# Altium schematic sheet Amplifier-TPA2016D2.SchDoc: Speaker Amplifier
size A; DocumentNumber: 7; SheetNumber: 7; SheetTotal: 9
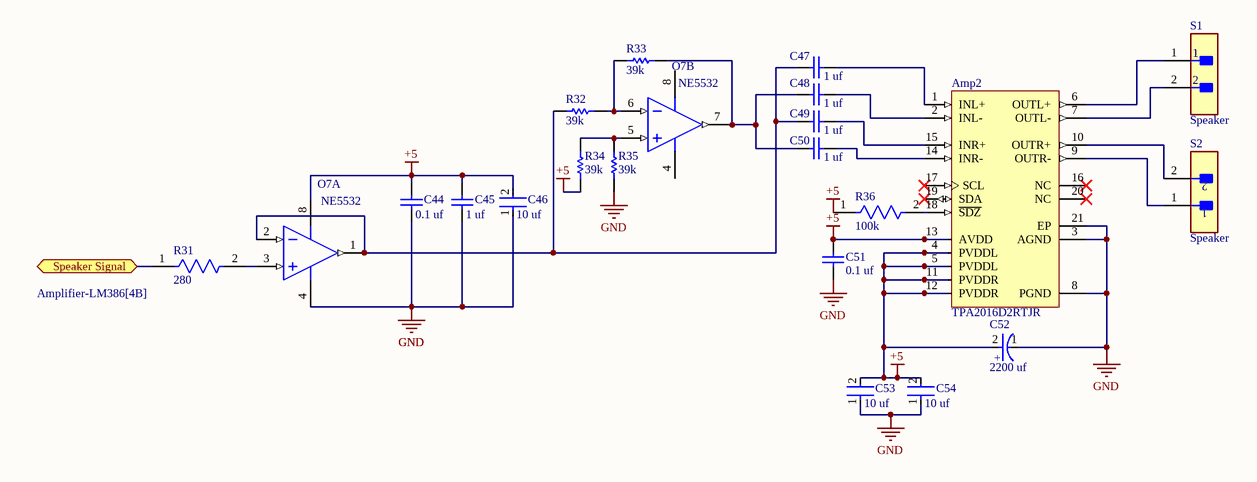
[diagram p0: Amplifier-TPA2016D2.SchDoc]

## Parts
Amp2  TPA2016D2RTJR  [RTJ0020D_V]
C44  0.1 uf  [CAPC2013X135X45ML10T25]
C45  1 uf  [CAPC2013X145X50LL20T25]
C46  10 uf  [FP-C0805C-DG-MFG]
C47  1 uf  [CAPC2013X135X45ML10T25]
C48  1 uf  [CAPC2013X135X45ML10T25]
C49  1 uf  [CAPC2013X135X45ML10T25]
C50  1 uf  [CAPC2013X135X45ML10T25]
C51  0.1 uf  [CAPC2013X135X45ML10T25]
C52  2200 uf  [FP-RAD-TH-D_10_0_5-L_16_1-MFG]
C53  10 uf  [FP-C0805C-DG-MFG]
C54  10 uf  [FP-C0805C-DG-MFG]
O7  NE5532  [ONSC-SOIC-8-751-07_V]  (parts A,B of 2)
R31  280  [FP-CRCW0805-e3-MFG]
R32  39k  [RESC2013X70X40NL20T20]
R33  39k  [RESC2013X70X40NL20T20]
R34  39k  [RESC2013X70X40NL20T20]
R35  39k  [RESC2013X70X40NL20T20]
R36  100k  [FP-RC0805-0_6-IPC_C]
S1  Speaker  [FP-B2B-XH-A_LF_SN-MFG]
S2  Speaker  [FP-B2B-XH-A_LF_SN-MFG]

## Ports
Speaker Signal (bidir, see Amplifier-LM386[4B])

## Nets
+5: Amp2.4(PVDDL) Amp2.5(PVDDL) Amp2.11(PVDDR) Amp2.12(PVDDR) Amp2.13(AVDD) C44.2 C45.1 C46.2 C51.2 C52.2(A) C53.2 C54.2 O7.8(V+) R34.1 R36.1
GND: Amp2.3(AGND) Amp2.8(PGND) Amp2.21(EP) C44.1 C45.2 C46.1 C51.1 C52.1(C) C53.1 C54.1 O7.4(V-) R35.1
Speaker Signal: R31.1 ; port Speaker Signal
NetAmp2_1: Amp2.1(INL+) C47.2
NetAmp2_2: Amp2.2(INL-) C48.2
NetAmp2_6: Amp2.6(OUTL+) S1.1
NetAmp2_7: Amp2.7(OUTL-) S1.2
NetAmp2_9: Amp2.9(OUTR-) S2.1
NetAmp2_10: Amp2.10(OUTR+) S2.2
NetAmp2_14: Amp2.14(INR-) C50.2
NetAmp2_15: Amp2.15(INR+) C49.2
NetAmp2_18: Amp2.18(~{SDZ}) R36.2
NetC47_1: C47.1 C49.1 O7.1(OUTA) O7.2(INA-) R32.1
NetC48_1: C48.1 C50.1 O7.7(OUTB) R33.2
NetO7_3: O7.3(INA+) R31.2
NetO7_5: O7.5(INB+) R34.2 R35.2
NetO7_6: O7.6(INB-) R32.2 R33.1

Not connected (* = marked no-connect by the designer): Amp2 16(NC)* 17(SCL)* 19(SDA)* 20(NC)*

## Notes on the sheet
- Title
- Size
- Date:
- A
- Drawn By:
- Sheet    of
- Revision
- File:
- Document Number:
- (in symbol CMP-05427-000639-1) +

## Library data of the parts
Amp2 = CMP-0991-00196-2: 2.8-W/Ch Stereo Class-D Audio Amplifier with SmartGainTM AGC / DRC, -40 to 85 degC, 20-pin QFN (RTJ20), Green (RoHS & no Sb/Br); Manufacturer: Texas Instruments; PSRR(dB): -80; Supply Max(Max)(Volt): 5.5; Output Power(W): 2.8; Supply Min(Min)(Volt): 2.5; SubFamily: Dynamic Speaker; PackageReference: RTJ0020D; ComponentLink3Description: Package Specification; ComponentLink1URL: http://www.ti.com/; ComponentLink2Description: Datasheet; Eco-Plan: Green (RoHS & no Sb/Br); ComponentLink1Description: Manufacturer URL; Speaker Channels: Stereo; Special Features: AGC/DRC; DatasheetVersion: SLOS524D; Speaker Amp Type: Class-D; PackageVersion: 4205505/F, 07/2011; PackageDescription: 20-pin Plastic Flat Pack, Body 4 x 4 mm, Pitch 0.5 mm; ComponentLink3URL: http://www.ti.com/litv/pdf/mpqf156e; Mounting Technology: Surface Mount; ComponentLink2URL: http://www.ti.com/general/docs/lit/getliterature.tsp?genericPartNumber=TPA2016D2&fileType=pdf; PartNumber: TPA2016D2RTJR
C44 C47-C51 = CMP-2100-03644-1: Chip Capacitor, 0.1 uF, +/- 10%, 50 V, -55 to 125 degC, 0805 (2012 Metric), RoHS, Tape and Reel; Manufacturer: Murata; Voltage: 50V; Capacitance: 100nF; Insulation Resistance: 10GR; Dielectric Material: Ceramic; Dielectric: X7R; Package Description: 2-Pin Surface Mount Device, Body 2 x 1.25 mm; Manufacturer URL: http://www.murata.com/; Case Code (Imperial): 0805; Datasheet URL: http://psearch.en.murata.com/capacitor/product/GRM21BR71H104KA01%23.pdf; Termination: SMD/SMT; Lead Free: LeadFree; Package Quantity: 1; Mount: SurfaceMount; REACH SVHC: Unknown; Thickness: 0.053inch; Height: 1.25mm; Case/Package: 0805; Voltage Rating: 50V; Width: 0.049inch; Case Code (Metric): 2012; Material: Ceramic; Min Operating Temperature: -55degC; RoHSCompliant: true; Datasheet Version: 42675.0; Voltage Rating (DC): 50V; Tolerance: 10%; Package Reference: 0805; Depth: 1.25mm; Length: 2mm; Max Operating Temperature: 125degC; Packaging: TapeandReel; Number of Pins: 2; Radiation Hardening: No
C45 = CMP-1036-04746-2: Manufacturer: Kemet; Part Number: C0805C105K4PACTU
C46 C53 C54 = CMP-2007-03243-2: CAP CER 10UF 10V X5R 0805; Manufacturer Part Number: C0805C106K8PACTU; Manufacturer: Kemet; 3DS Part Number: 220-00001; Tolerance: 10%; Temperature Coefficient: 15%; Material: Ceramic; Device Class L2: Capacitors; Device Class L1: Passive Components; ComponentLink2URL: https://content.kemet.com/datasheets/KEM_C1006_X5R_SMD.pdf; Height: 1.4mm; Lead Free: Yes; Digikey Description: CAP CER 10UF 10V X5R 0805; Octopart: https://octopart.com/c0805c106k8pactu-kemet-98697; Capacitance: 10uF; Value: 10uF; Temperature Range Low: -55°C; Temperature: -55°C to +85°C; Automotive: No; Mouser Description: CAP CER 10UF 10V X5R 0805; Ipc Land Pattern Name: CAPC200125X125; Temperature Range High: +85°C; Voltage: 10V; RoHS: TRUE; Device Class L3: Ceramic Capacitors; ComponentLink2Description: Datasheet; Voltage Rating: 10V; Package: C0805C-DG; Temperature Characteristic: X5R; Category: Cap
C52 = CMP-05427-000639-1: Aluminum Electrolytic Capacitors (Radial Lead Type) AEC-Q200 Qualified 470uF ±20% 25V; Dielectric Material: Aluminium; Leakage Current: 3uA; ESR (Equivalent Series Resistance): 68mR; Lead Diameter: 0.6mm; Ripple Current: 1.05A; Life (Hours): 3000Hour; Termination: Radial; Length: 16mm; RoHS Compliant: Yes; Series: FC; Tolerance: 20%; Package Quantity: 200; Radiation Hardening: No; Case/Package: Radial; Voltage Rating: 25V; Voltage: 25V; Contact Plating: Tin; Construction: RADIAL; Max Operating Temperature: 105°C; Min Operating Temperature: -55°C; REACH SVHC: No SVHC; Height: 16mm; Ratings: AEC-Q200; Packaging: Bulk; Mount: Through Hole; Diameter: 10mm; Capacitance: 470uF; Impedance: 68mR; Height - Seated (Max): 0.63inch; Lead Free: Lead Free; Ripple Current (AC): 1.05A; Voltage Rating (DC): 25V; Lead Pitch: 5mm; Size: 16mm
O7 = CMP-1310-00252-1: Internally Compensated Dual Low Noise Operational Amplifier, 6 to 40 V, 0 to 70 degC, 8-Pin SOIC, Pb-Free, Tape and Reel; Manufacturer: On Semiconductor; PartNumber: NE5532AD8R2G; SR Typ (V/uS): 9; VCC Min (V): 6; VCC Max (V): 40; GBW Typ (MHz): 10; PackageVersion: Rev. AK, 02/2011; ComponentLink2URL: http://www.onsemi.cn/pub_link/Collateral/NE5532-D.PDF; RoHS: TRUE; PackageReference: SOIC-8-751-07; ComponentLink2Description: Datasheet; PackageDescription: 8-Pin Small Outline Integrated Circuit, Body 4.9 x 3.9 mm, Pitch 1.27 mm; ComponentLink3URL: http://www.onsemi.com/pub_link/Collateral/751-07.PDF; ComponentLink1Description: Manufacturer URL; DatasheetVersion: Rev. 2; Packing: Tape and Reel; ComponentLink1URL: http://www.onsemi.com/; ComponentLink3Description: Package Specification; Mounting Technology: Surface Mount
R31 = CMP-2001-03748-2: RES Thick Film, 280Ω, 1%, 0.125W, 100ppm/°C, 0805; Power Rating: 125mW; Resistance: 280R; Voltage Rating (DC): 150V; Composition: Thick Film; Radiation Hardening: No; Width: 1.25mm; Lead Free: Lead Free; Depth: 1.25mm; Case Code (Imperial): 0805; Packaging: Tape and Reel; Weight: 0.000194oz; Number of Terminations: 2; Military Standard: Not; Contact Plating: Tin; Package Quantity: 10; Voltage Rating: 150V; Tolerance: 1%; Max Operating Temperature: 155°C; Case Code (Metric): 2012; Max Power Dissipation: 125mW; Temperature Coefficient: 100ppm/°C; Case/Package: 0805; Length: 2mm; Termination: SMD/SMT; Min Operating Temperature: -55°C; Height: 0.02inch; Features: Automotive AEC-Q200
R32-R35 = CMP-2001-00410-1: Part Number: ERJ-6GEYJ393V; Manufacturer: Panasonic
R36 = CMP-2100-03668-5: RES 100K OHM 1% 1/8W 0805; Power Rating: 125mW; Temperature Coefficient: 100ppm/°C; Voltage Rating (DC): 150V; Resistance: 100kR; Package Quantity: 1; Case/Package: 0805; Lead Pitch: 0.4mm; Case Code (Imperial): 0805; Construction: Rectangular; Number of Terminations: 2; RoHS Compliant: Yes; Max Power Dissipation: 125mW; Tolerance: 1%; Max Operating Temperature: 155°C; Resistance Tolerance: 1%; Lead Free: Lead Free; Packaging: Tape and Reel; Resistor Type: Thick Film; Min Operating Temperature: -55°C; Case Code (Metric): 2012; Series: RC; Technology: THICK FILM; Voltage Rating: 150V; Termination: SMD/SMT; Width: 0.049inch; Number of Pins: 2; Features: Moisture Resistant; Military Standard: Not; Length: 0.079inch; Depth: 1.25mm; Size Code: 0805; Height: 0.024inch
S1 S2 = CMP-2000-05888-3: CONN HEADER VERT 2POS 2.5MM; Current Rating: 3A; Voltage Rating: 250V; Number of Contacts: 2; Contact Resistance: 20mR; Wire/Cable Gauge: 22AWG; Insulation Resistance: 1GR; Connector Type: Male Pin; Packaging: Bulk; Contact Material: Brass; Lead Free: Lead Free; Orientation: Straight; Contact Plating: Tin; Max Current Rating: 3A; Termination: Solder; Fastening Type: Detent; Depth: 5.75mm; Housing Material: Polyamide; REACH SVHC: No SVHC; Series: XH; Voltage Rating (AC): 250V; Number of Positions: 2; Color: Natural; Contact Type: Male Pin; Max Voltage Rating (DC): 250V; Pitch: 2.5mm; Lead Pitch: 2.5mm; Mount: Through Hole; Max Operating Temperature: 85°C; Length: 7.4mm; Max Voltage Rating (AC): 250V; Min Operating Temperature: -25°C; Number of Rows: 1; Housing Color: White